# EAGLE design 01072016wearable_v1.2 - OK (EAGLE 7.6.0)
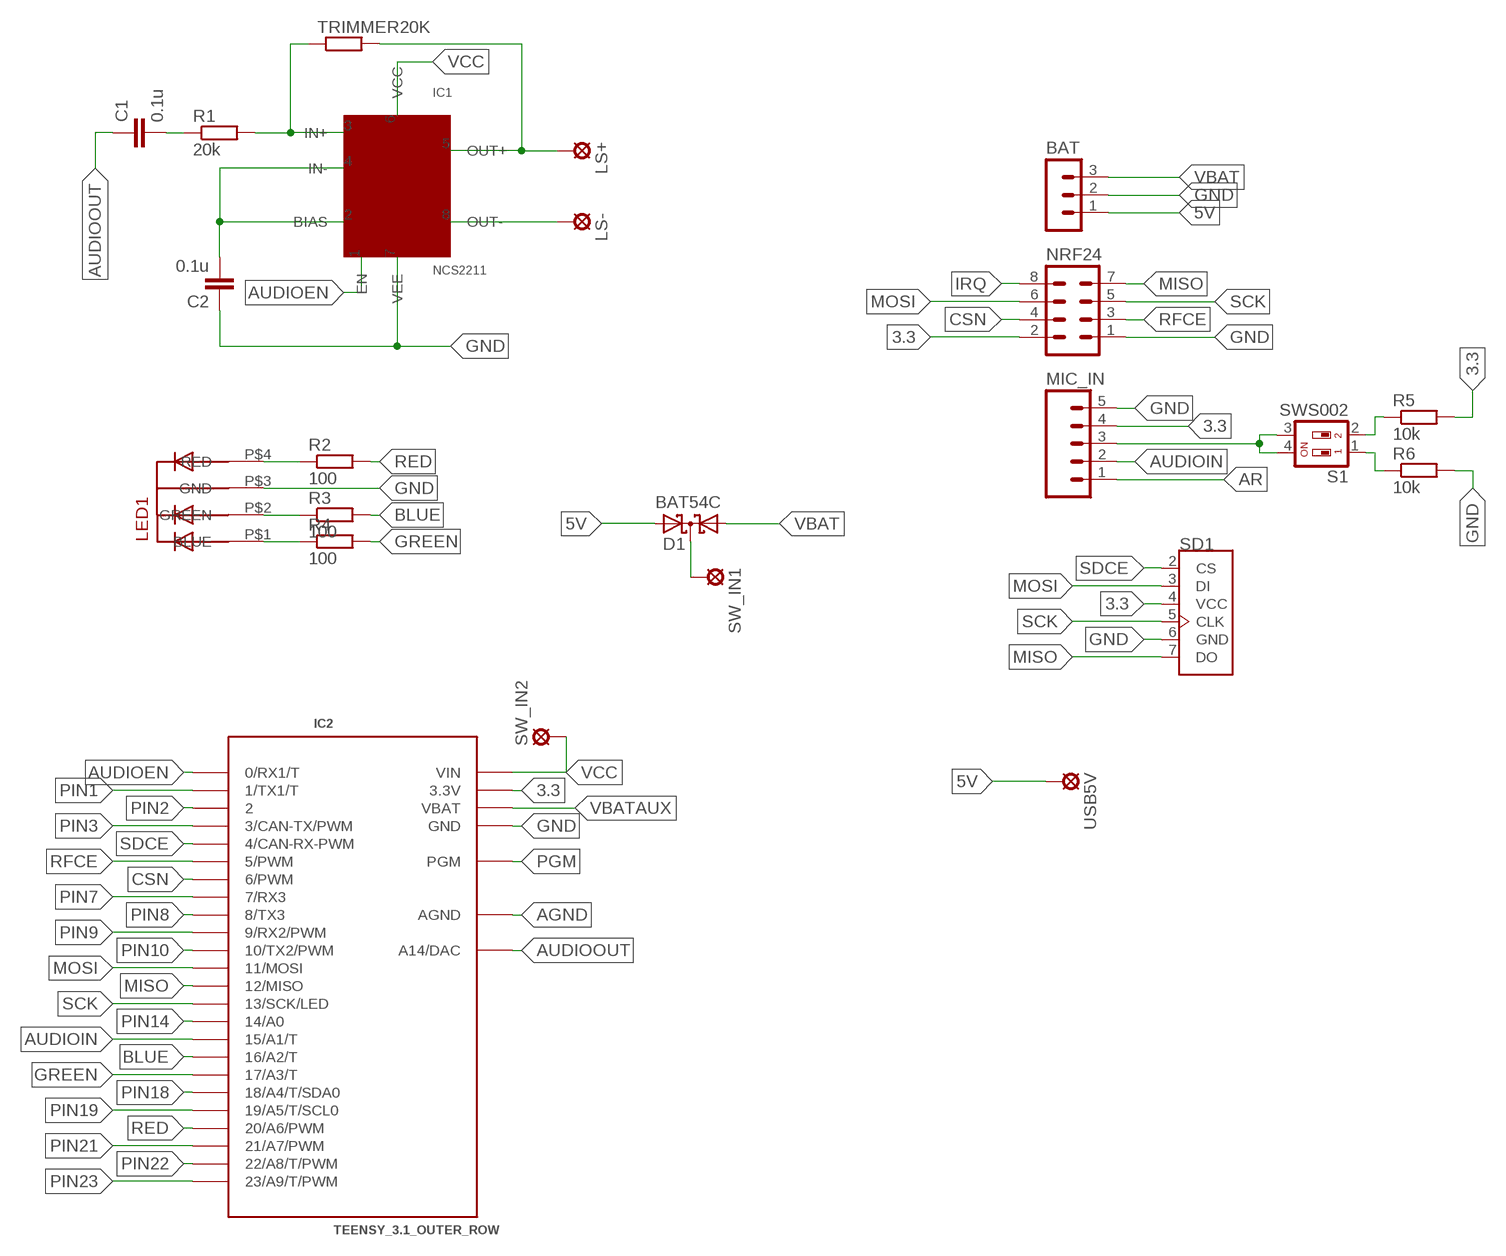
[diagram p0: schematic, sheet 1]

## Parts
BAT  MA03-1  [MA03-1]
C1  0.1u  C2.5/2  [C2.5-2]
C2  0.1u  C2.5/2  [C2.5-2]
D1  BAT54C  [SOT23]
IC1  NCS2211  [SOIC-8]
IC2  TEENSY_3.1_OUTER_ROW  [TEENSY3-OUTER_ROW]
LED1  5MMRGBLED  [LED5MMRGB]
LS+  LSP10  [LSP10]
LS-  LSP10  [LSP10]
MIC_IN  MA05  [05PA]
NRF24  MA04-2  [MA04-2]
R1  20k  R-EU_0204/7  [0204/7]
R2  100  R-EU_0207/2V  [0207/2V]
R3  100  R-EU_0207/2V  [0207/2V]
R4  100  R-EU_0207/2V  [0207/2V]
R5  10k  R-EU_0207/2V  [0207/2V]
R6  10k  R-EU_0207/2V  [0207/2V]
S1  SWS002  [SMS-002]
SD1  MICROSD_SF-MICROSD  [MICROSD_MICROSD]
SW_IN1  SE11  [SE11]
SW_IN2  SE11  [SE11]
TRIMMER20K  R-EU_0207/2V  [0207/2V]
USB5V  LSP10  [LSP10]

## Nets
3.3 [3.3]: IC2.3.3V IC2.3.3V1(3.3V) MIC_IN.4 NRF24.2 R5.2 SD1.4(VCC)
5V [3.3]: BAT.1 D1.2(A2) USB5V.MP
AGND: IC2.AGND
AR: MIC_IN.1
AUDIOEN: IC1.1(EN) IC2.0(0/RX1/T)
AUDIOIN: IC2.15/A1(15/A1/T) MIC_IN.2
AUDIOOUT: C1.1 IC2.RESET/DAC(A14/DAC)
BLUE: IC2.16/A2(16/A2/T) R3.2
CSN: IC2.6(6/PWM) NRF24.4
GAIN: MIC_IN.3 S1.3 S1.4
GND [GND]: BAT.2 C2.1 IC1.7(VEE) IC2.GND IC2.GND1(GND) LED1.P$3(GND) MIC_IN.5 NRF24.1 R6.2 SD1.6(GND)
GREEN: IC2.17/A3(17/A3/T) R4.2
IRQ: NRF24.8
MISO: IC2.12(12/MISO) NRF24.7 SD1.7(DO)
MOSI: IC2.11(11/MOSI) NRF24.6 SD1.3(DI)
N$1: D1.3(CC) SW_IN1.MP
N$2: IC1.5(OUT+) LS+.MP TRIMMER20K.2
N$3: IC1.3(IN+) R1.2 TRIMMER20K.1
N$4: C1.2 R1.1
N$5: C2.2 IC1.2(BIAS) IC1.4(IN-)
N$6: IC1.8(OUT-) LS-.MP
N$7: LED1.P$4(RED) R2.1
N$8: LED1.P$1(BLUE) R4.1
N$9: LED1.P$2(GREEN) R3.1
N$11: R5.1 S1.2
N$12: R6.1 S1.1
PGM: IC2.PGM
PIN1: IC2.1(1/TX1/T)
PIN2: IC2.2
PIN3: IC2.3(3/CAN-TX/PWM)
PIN7: IC2.7(7/RX3)
PIN8: IC2.8(8/TX3)
PIN9: IC2.9(9/RX2/PWM)
PIN10: IC2.10(10/TX2/PWM)
PIN14: IC2.14/A0
PIN18: IC2.18/A4(18/A4/T/SDA0)
PIN19: IC2.19/A5(19/A5/T/SCL0)
PIN21: IC2.21/A7(21/A7/PWM)
PIN22: IC2.22/A8(22/A8/T/PWM)
PIN23: IC2.23/A9(23/A9/T/PWM)
RED: IC2.20/A6(20/A6/PWM) R2.2
RFCE: IC2.5(5/PWM) NRF24.3
SCK: IC2.13(13/SCK/LED) NRF24.5 SD1.5(CLK)
SDCE: IC2.4(4/CAN-RX-PWM) SD1.2(CS)
VBAT [3.3]: BAT.3 D1.1(A1)
VBATAUX: IC2.VBAT
VCC: IC1.6(VCC) IC2.VIN SW_IN2.MP

## Library data of the parts
BAT = con-lstb:MA03-1: PIN HEADER; OC_FARNELL: unknown; OC_NEWARK: unknown
C1 C2 = capacitor-wima:C: CAPACITOR naming: grid - package width
D1 = diode:BAT54C: Schottky Diodes Source: Fairchild .. BAT54.pdf
IC1 = NCS2211:NCS2211
IC2 = Teensy_3_and_LC_Series_Boards_v1.1:TEENSY_3.1_OUTER_ROW: Footprint for Teensy 3.1 or 3.2 board using all pin connections on the outer perimeter
LED1 = led_rgb:5MMRGBLED
LS+ LS- USB5V = solpad:LSP10: SOLDER PAD drill 1.0 mm, distributor Buerklin, 12H555
MIC_IN = con-amp-quick:MA05: AMP QUICK CONNECTOR; OC_FARNELL: unknown; OC_NEWARK: unknown
NRF24 = con-lstb:MA04-2: PIN HEADER; OC_FARNELL: unknown; OC_NEWARK: unknown
R1-R6 TRIMMER20K = rcl:R-EU_: RESISTOR, European symbol
S1 = smd-special:SWS002: SMD Dip Switch 2 pol.
SD1 = sd:MICROSD_SF-MICROSD
SW_IN1 SW_IN2 = solpad:SE11: SOLDER PAD RTM, drill 1,1mm, distributor Buerklin, 07F810

## Net classes
0 default: width 0.61 mm, clearance 0.3 mm
1 GND: width 0.61 mm, clearance 0.3 mm
2 3.3: width 0.61 mm, clearance 0.3 mm

## Board
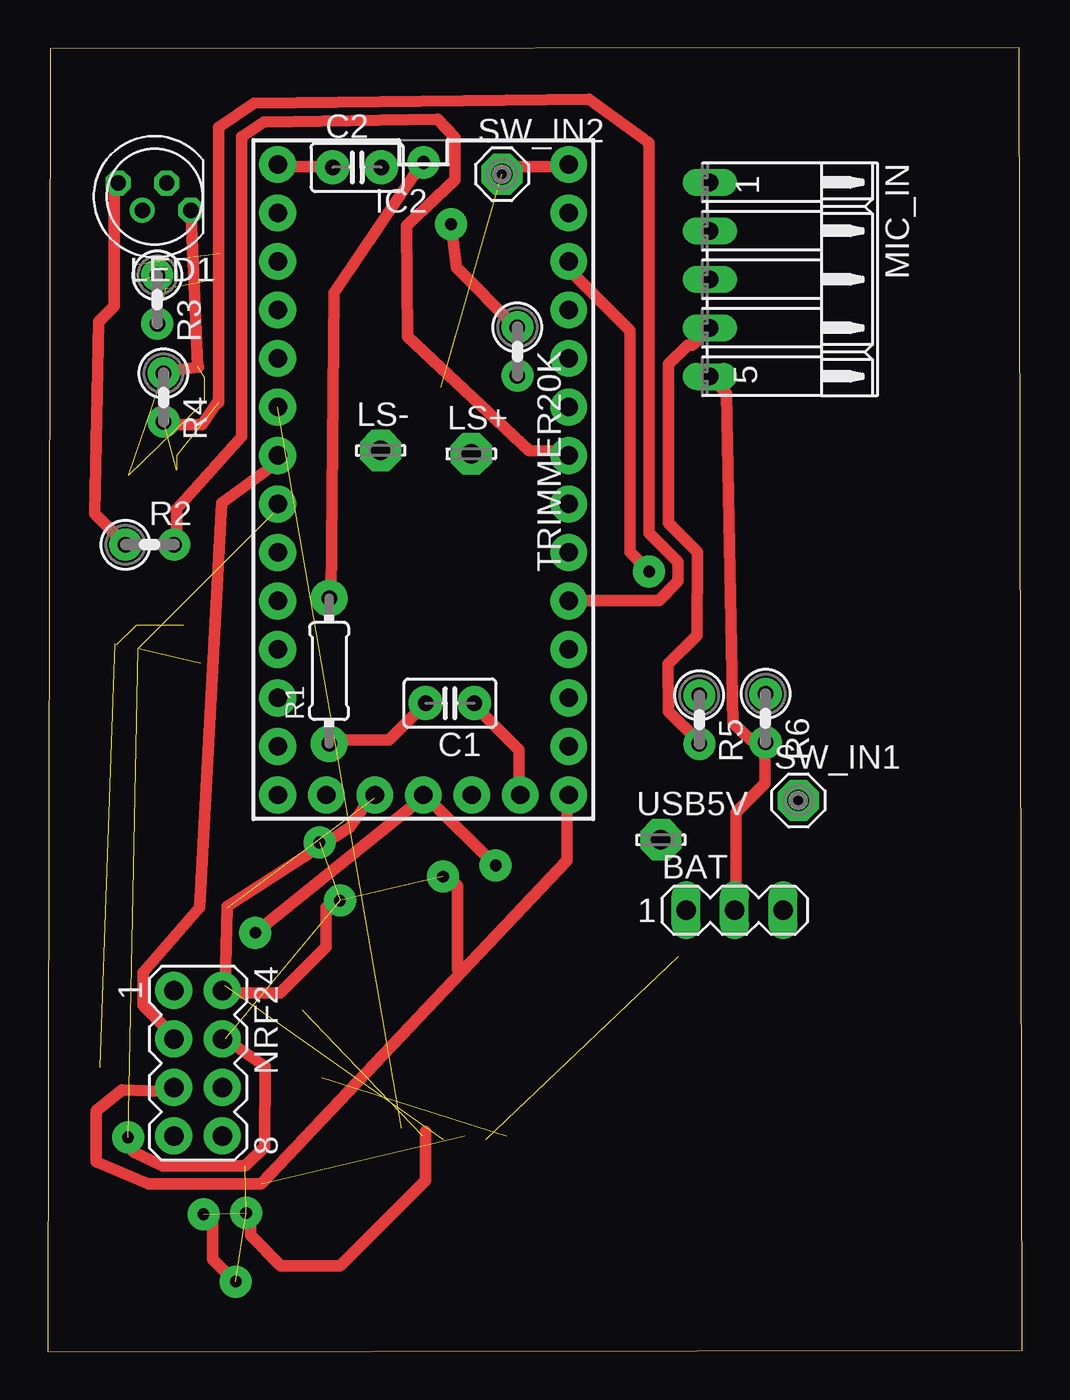
[diagram p1: board, top side]
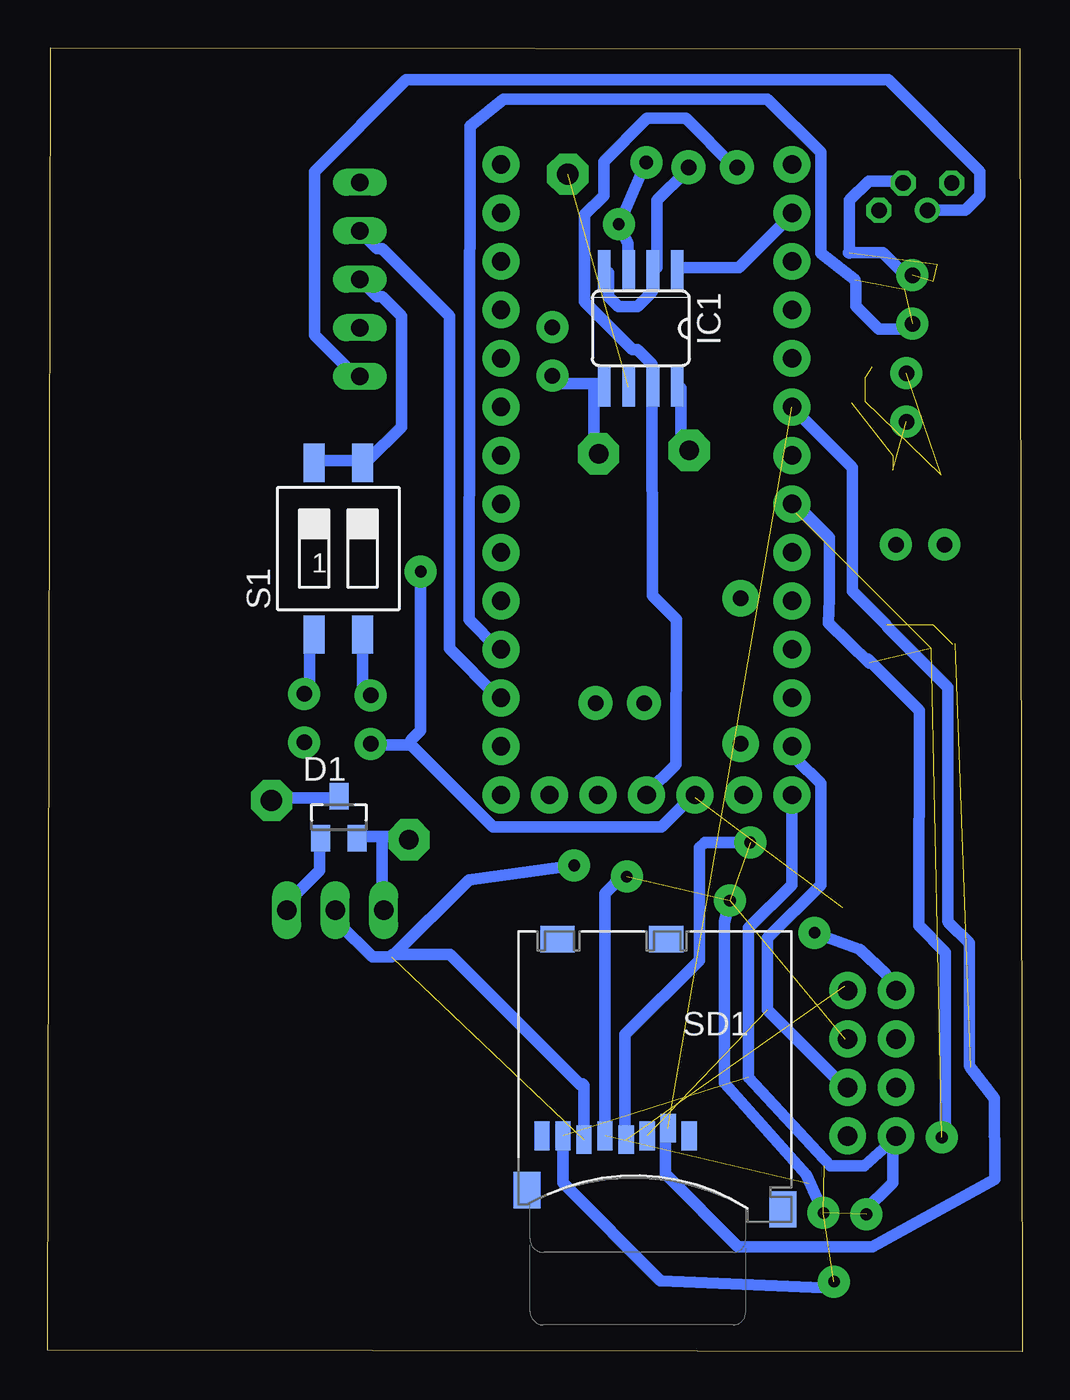
[diagram p2: board, bottom side, seen from below]

Size 51.03 x 68.29 mm. Coordinates in mm from the lower left corner, seen from the top.
Outline: 0,0 51.03,0.09 50.88,68.29 0.12,68.25 0,0
Copper layers (1*16): Top 0.035mm / dielectric 1.5mm / Bottom 0.035mm
Design rules "default *": minimum track width 10mil, minimum drill 24mil, track to track 0.3mm, track to pad 0.3mm, pad to pad 0.3mm, via to via 0.3mm, smd to smd 0.3mm, copper to edge 40mil, drill to drill 8mil, minimum pad ring 10mil, minimum via ring 0.3mm, stop-mask expansion 4mil, vias tented up to drill 0mil, thermal gap 10mil

### Footprints (pad centres in the part's own frame; a part is rotated, then mirrored left to right if it is on the bottom)
MA03-1 = drill 1.016 long: 1 -2.54,0; 2 0,0; 3 2.54,0
C2.5-2 = drill 0.813 pad 1.778: 1 -1.27,0; 2 1.27,0
SOT23 = smd 1 x 1.4: 1 -0.95,-1.1; 2 0.95,-1.1; 3 0,1.1
SOIC-8 = smd 0.66 x 2.032: 1 -1.905,-3.073; 2 -0.635,-3.073; 3 0.635,-3.073; 4 1.905,-3.073; 5 1.905,3.073; 6 0.635,3.073; 7 -0.635,3.073; 8 -1.905,3.073
TEENSY3-OUTER_ROW = drill 0.965 pad 1.93: 0 -7.62,13.97; 1 -7.62,11.43; 2 -7.62,8.89; 3 -7.62,6.35; 3.3V 7.62,11.43; 3.3V1 -2.54,-16.51; 4 -7.62,3.81; 5 -7.62,1.27; 6 -7.62,-1.27; 7 -7.62,-3.81; 8 -7.62,-6.35; 9 -7.62,-8.89; 10 -7.62,-11.43; 11 -7.62,-13.97; 12 -7.62,-16.51; 13 7.62,-16.51; 14/A0 7.62,-13.97; 15/A1 7.62,-11.43; 16/A2 7.62,-8.89; 17/A3 7.62,-6.35; 18/A4 7.62,-3.81; 19/A5 7.62,-1.27; 20/A6 7.62,1.27; 21/A7 7.62,3.81; 22/A8 7.62,6.35; 23/A9 7.62,8.89; AGND 7.62,13.97; GND -7.62,16.51; GND1 0,-16.51; PGM 2.54,-16.51; RESET/DAC 5.08,-16.51; VBAT -5.08,-16.51; VIN 7.62,16.51
LED5MMRGB = drill 0.8 pad 0.813 octagon: P$1 -1.905,0.714; P$2 -0.635,-0.714; P$4 1.905,-0.714 | drill 0.8 pad 0.813: P$3 0.635,0.714
LSP10 = drill 1.016 pad 2.159 octagon: MP 0,0
05PA = drill 0.914 long: 1 -5.08,0; 2 -2.54,0; 3 0,0; 4 2.54,0; 5 5.08,0
MA04-2 = drill 1.016 pad 1.93: 1 -3.81,-1.27; 2 -3.81,1.27; 3 -1.27,-1.27; 4 -1.27,1.27; 5 1.27,-1.27; 6 1.27,1.27; 7 3.81,-1.27; 8 3.81,1.27
0204/7 = drill 0.813 pad 1.93: 1 -3.81,0; 2 3.81,0
0207/2V = drill 0.813 pad 1.676: 1 -1.27,0; 2 1.27,0
SMS-002 = smd 1.092 x 2.007: 1 -1.27,-4.496; 2 1.27,-4.496; 3 1.27,4.496; 4 -1.27,4.496
MICROSD_MICROSD = smd 0.8 x 1.5: 1 -1.94,2.7; 2 -0.84,2.3; 3 0.26,2.7; 4 1.36,2.9; 5 2.46,2.7; 6 3.56,2.9; 7 4.66,2.7; 8 5.76,2.7 | smd 1.4 x 1.9: NC -6.85,6.55; NC3 6.55,5.55 | smd 1.8 x 1.4: NC1 -0.75,-7.6; NC2 4.95,-7.6
SE11 = drill 1.118 pad 2.159 octagon: MP 0,0

### Placement (x,y rotation side)
BAT  35.97,23.12 0 top
C1  21.07,33.97 180 top
C2  16.2,62.03 0 top
D1  35.78,27.99 0 bottom
IC1  19.97,53.59 180 bottom
IC2  19.67,45.67 0 top
LED1  5.59,60.49 180 top
LS+  22.18,47.02 0 top
LS-  17.43,47.2 0 top
MIC_IN  34.68,56.16 270 top
NRF24  7.87,15.11 270 top
R1  14.74,35.65 90 top
R2  5.34,42.26 0 top
R3  5.74,55.1 270 top
R4  6.06,49.97 270 top
R5  34.12,33.1 270 top
R6  37.6,33.18 270 top
S1  35.81,42.06 0 bottom
SD1  19.38,14.01 180 bottom
SW_IN1  39.31,28.87 0 top
SW_IN2  23.79,61.67 0 top
TRIMMER20K  24.6,52.38 270 top
USB5V  32.11,26.81 0 top

### Tracks (layer width: path | path; a pad name or v marks a point on that pad's centre or on a via)
3.3  (via drill 0.61 pad 1.68)  (2 unrouted)
  Top 0.61: MIC_IN.4 34.53,53.48 33.77,52.72 33.52,52.72 32.51,51.71 32.51,43.39 34.02,41.87 34,37.52 32.49,36 32.51,33.54 34.02,32.03 R5.2 | v31.5,40.86 30.49,41.87 30.49,53.48 27.46,56.51 27.46,57.01 IC2.3.3V | 9.4,23.23 9.29,19.16 NRF24.2 | 17.11,29 IC2.3.3V1
  Bottom 0.61: 32,31.77 34.02,31.77 R5.2 | 32,31.77 27.71,27.48 18.88,27.48 17.36,29 IC2.3.3V1 | v31.5,40.86 31.5,32.53 32,32.03 32,31.77
5V
  Bottom 0.61: 33.52,26.98 32.26,26.98 USB5V.MP | 33.52,26.98 34.78,26.98 D1.2 | 33.52,26.98 33.52,23.19 BAT.1
AUDIOEN
  Bottom 0.61: IC1.1 17.87,56.76 14.84,56.76 12.06,59.54 IC2.0
AUDIOIN
  Bottom 0.61: MIC_IN.2 34.53,58.53 33.77,57.77 33.52,57.77 29.98,54.24 29.98,36.82 27.46,34.3 IC2.15/A1
AUDIOOUT
  Top 0.61: IC2.RESET/DAC 24.68,29.25 24.68,31.52 22.41,33.79 C1.1
BLUE  (2 unrouted)
  Bottom 0.61: 8.76,56.13 10.55,57.52 10.55,62.82 13.33,65.6 27.16,65.6 28.91,64.17 28.97,38.34 27.46,36.82 IC2.16/A2
CSN  (via drill 0.61 pad 1.68)  (8 unrouted)
  Top 0.61: v4.2,11.23 4.46,10.46 6.02,9.73 10.34,9.73 11.35,10.74 11.38,14.94 9.29,16.38 NRF24.4
  Bottom 0.61: 11.81,43.89 11.81,44.39 IC2.6
  other vias: 8.15,7.2 9.85,3.67 20.7,24.88 14.23,26.67 10.39,7.27 15.3,23.63
GAIN
  Bottom 0.61: S1.4 37.05,46.67 34.78,46.67 S1.3 34.27,46.67 32.51,48.43 32.51,54.24 33.52,55.25 33.77,55.25 34.53,56.01 MIC_IN.3
GND  (via drill 0.61 pad 1.68)  (1 unrouted)
  Top 0.61: IC2.GND 12.06,62.06 14.84,62.06 C2.1 | v10.87,21.94 19.64,29 IC2.GND1 19.89,29 v23.46,25.47 | BAT.2 36.04,23.19 36.04,28.24 37.56,29.76 37.56,31.77 R6.2 37.56,32.03 36.85,32 35.9,32.93 35.54,50.2 34.78,50.96 MIC_IN.5
  Bottom 0.61: IC2.GND1 19.64,29.25 18.12,30.77 18.1,38.34 19.36,39.6 19.38,50.45 IC1.7 19.38,50.7 19.38,51.71 20.14,52.47 20.39,52.47 22.92,55 22.92,59.54 21.91,60.55 21.91,62.32 19.64,64.59 17.62,64.59 15.09,62.06 C2.1 | v10.87,21.94 8.51,21.06 7.16,19.82 6.76,19.16 NRF24.1 | LED1.P$3 4.74,59.79 2.98,59.79 2.22,60.55 2.22,61.81 7.02,66.61 32.26,66.61 37.05,61.81 37.05,53.23 34.78,50.96 MIC_IN.5 | v23.46,25.47 28.97,24.71 33.01,20.67 34.02,20.67 35.79,22.44 35.79,22.94 BAT.2
GREEN  (3 unrouted)
  Top 0.61: 8.94,49.7 8.94,64.12 10.81,65.4 28.35,65.61 31.48,63.3 31.5,42.88 33.01,41.37 33.01,40.36 32,39.35 27.46,39.35 IC2.17/A3
MISO  (1 unrouted)
  Bottom 0.61: IC2.12 12.06,29 12.06,24.46 14.34,22.18 14.34,14.36 10.03,9.73 8.27,9.73 6.76,11.08 NRF24.7
MOSI  (1 unrouted)
  Bottom 0.61: IC2.11 11.81,31.52 11.81,31.02 10.55,29.76 10.55,24.46 13.33,21.68 13.33,17.89 9.29,13.86 NRF24.6
N$1
  Bottom 0.61: D1.3 35.79,29 39.07,29 SW_IN1.MP
N$2
  Bottom 0.61: 22.41,50.7 24.18,50.7 24.43,50.96 TRIMMER20K.2 | 22.41,50.7 21.91,50.7 IC1.5 | 22.41,50.7 22.41,47.17 LS+.MP
N$3  (via drill 0.61 pad 1.68, 0.7 pad 1.68)
  Top 0.61: v21.12,59.05 21.4,56.76 24.43,53.73 TRIMMER20K.1 | v19.68,62.28 19.13,61.56 15.01,55.48 14.84,39.6 R1.2
  Bottom 0.61: IC1.3 20.65,56.76 20.65,58.02 v21.12,59.05 20.93,59.45 20.01,61.55 v19.68,62.28
N$4
  Top 0.61: R1.1 14.84,32.03 17.87,32.03 19.64,33.79 C1.2
N$5
  Bottom 0.61: C2.2 17.62,61.81 19.13,60.3 19.13,56.76 IC1.2 19.38,56.51 19.38,55.5 20.14,54.74 21.15,54.74 21.65,55.25 21.65,56.51 IC1.4
N$6
  Bottom 0.61: IC1.8 17.87,50.45 17.87,47.68 17.62,47.42 LS-.MP
N$7
  Top 0.61: LED1.P$4 3.48,61.05 3.48,54.77 2.67,53.96 2.47,43.89 3.99,42.38 R2.1
N$8  (4 unrouted)
  Top 0.61: 7.84,51.59 7.52,59.54 LED1.P$1
N$9  (3 unrouted)
  Bottom 0.61: 9.04,57.52 9.04,60.3 8.03,61.31 6.26,61.31 LED1.P$2
N$10
  Top 0.61: 17.11,29.15 17.08,29.12 17.08,28.84
N$11
  Bottom 0.61: S1.2 34.53,37.33 34.53,34.8 34.27,34.55 R5.1
N$12
  Bottom 0.61: S1.1 37.3,37.33 37.3,34.8 37.56,34.55 R6.1
N$13
  Top 0.61: 16.94,29.05 15.81,27.47 9.39,23.32
N$14
  Bottom 0.61: 4.01,11.13 4.01,20.91 5.42,22.32 5.39,33.57 8.07,36.28
N$15  (1 unrouted)
  Bottom 0.61: 2.72,14.9 1.46,13.26 1.44,9.15
N$16
  Bottom 0.61: 18.69,11.99 18.69,9.31 14.88,5.5 7.84,5.5 1.43,9.03
N$17
  Bottom 0.61: 6.78,11.27 6.78,8.84 8.33,7.29
N$18
  Bottom 0.61: 24.05,11.41 24.05,8.84 18.93,3.72 9.8,3.32 9.66,3.79
N$19
  Top 0.61: 8.63,7.22 8.63,4.85 9.73,3.75
N$20
  Bottom 0.61: 32.98,20.81 29.95,20.81 23.09,13.95
N$21
  Bottom 0.61: 23.02,14.02 22.95,13.95 22.95,10.72
N$22
  Top 0.61: 20.93,24.93 21.47,24.39 21.47,20.02
N$23
  Bottom 0.61: 20.89,24.96 21.85,24 21.85,11.17
N$24
  Bottom 0.61: 16.91,22.94 16.91,20.5 20.79,16.62 20.79,10.79
N$25
  Top 0.61: 19.78,11.54 19.78,8.97 15.32,4.51 12.2,4.51 10.62,6.09 10.62,6.95 10.38,7.19
N$26
  Bottom 0.61: 10.38,7.22 11.29,9.27 15.6,14.08 15.6,22.48 15.31,23.65
N$27
  Top 0.61: 9.31,18.79 12.17,18.79 14.57,21.19 14.57,23.28 15.25,23.66
N$28
  Bottom 0.61: 16.9,22.87 16.9,26.4 16.62,26.68 14.63,26.68
N$29  (1 unrouted)
  Bottom 0.61: 8.01,36.07 10.14,38.17 10.1,39.41 10.1,42.63 11.99,44.52
N$30  (2 unrouted)
  Bottom 0.61: 7.12,38.07 8.9,39.85 8.9,46.31 11.99,49.4 12.13,49.4
N$31
  Bottom 0.406: 7.08,37.96 7.05,37.96 | 3.88,22.57 3.85,22.54 3.85,22.49 | 2.77,14.99 2.47,14.69
  Bottom 0.61: 7.05,37.96 3.88,34.79 3.88,22.57 | 3.85,22.49 2.77,21.41 2.77,14.99
N$32
  Bottom 0.61: 9.1,57.56 7.3,57.56 5.9,56.16
N$33
  Bottom 0.406: 6.3,53.56 5.9,53.96
  Bottom 0.61: 8.7,55.96 8.7,54.76 7.5,53.56 6.3,53.56
N$34
  Top 0.406: 6.3,51.36 6.1,51.16
  Top 0.61: 7.9,51.56 6.3,51.36
N$35
  Top 0.406: 6.3,48.56 6.1,48.76
  Top 0.61: 8.9,49.76 8.1,48.56 6.3,48.56
RED
  Top 0.61: R2.2 6.76,42.38 6.76,44.14 10.15,47.93 10.15,63.62 11.32,64.39 20.41,64.56 21.34,63.58 21.33,61.37 18.8,58.97 18.85,53.16 25.21,47.19 27.21,47.17 IC2.20/A6
RFCE
  Top 0.61: IC2.5 11.81,46.92 11.81,46.41 9.1,44.44 7.95,23.27 5,19.88 5,18.15 6.51,16.63 NRF24.3
SCK  (1 unrouted)
  Top 0.61: IC2.13 27.21,29 27.21,25.72 11.18,8.81 5.25,8.81 2.55,9.94 2.55,12.63 3.91,13.7 6.51,13.6 NRF24.5
SDCE  (1 unrouted)
VBAT
  Bottom 0.61: D1.1 36.8,26.73 36.8,25.21 38.31,23.7 38.31,23.19 BAT.3
VCC  (1 unrouted)
  Top 0.61: IC2.VIN 27.21,62.06 24.18,62.06 23.93,61.81 SW_IN2.MP